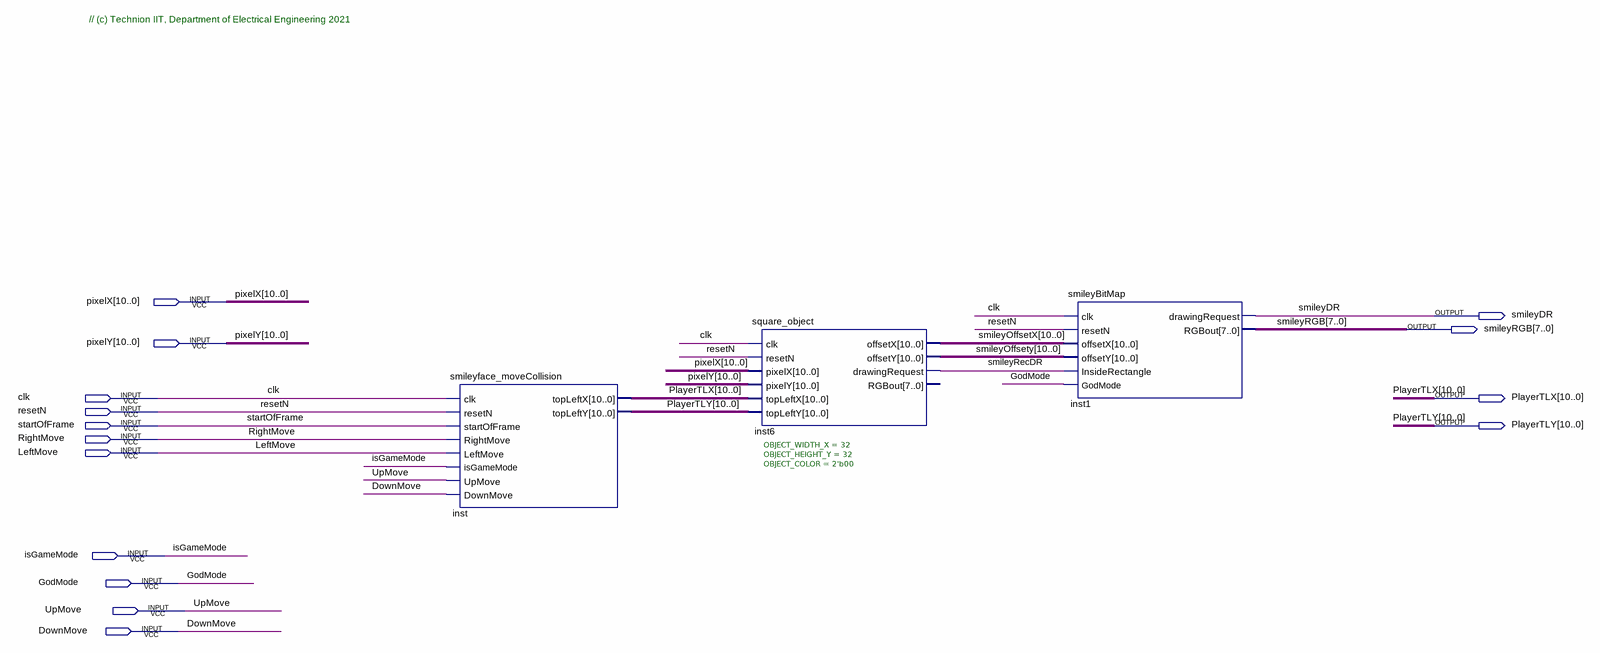
[diagram p0: schematic sheet]
// Quartus schematic Smiley_Block.bdf as structural Verilog: 3 symbols, 15 pins
module Smiley_Block (
  input  [10:0] pixelX,
  input  [10:0] pixelY,
  input  clk,
  input  resetN,
  input  startOfFrame,
  input  RightMove,
  input  LeftMove,
  input  isGameMode,
  input  GodMode,
  input  UpMove,
  input  DownMove,
  output smileyDR,
  output [7:0] smileyRGB,
  output [10:0] PlayerTLX,
  output [10:0] PlayerTLY
);

  wire smileyRecDR;
  wire [10:0] smileyOffsetX, smileyOffsety;

  smileyface_moveCollision inst (
    .clk(clk), .resetN(resetN), .startOfFrame(startOfFrame), .RightMove(RightMove), .LeftMove(LeftMove),
    .isGameMode(isGameMode), .UpMove(UpMove), .DownMove(DownMove), .topLeftX(PlayerTLX), .topLeftY(PlayerTLY));
  square_object #(.OBJECT_WIDTH_X(32), .OBJECT_HEIGHT_Y(32), .OBJECT_COLOR(2'b00)) inst6 (
    .clk(clk), .resetN(resetN), .pixelX(pixelX), .pixelY(pixelY), .topLeftX(PlayerTLX), .topLeftY(PlayerTLY),
    .offsetX(smileyOffsetX), .offsetY(smileyOffsety), .drawingRequest(smileyRecDR));  // open: RGBout
  smileyBitMap inst1 (
    .clk(clk), .resetN(resetN), .offsetX(smileyOffsetX), .offsetY(smileyOffsety),
    .InsideRectangle(smileyRecDR), .GodMode(GodMode), .drawingRequest(smileyDR), .RGBout(smileyRGB));

  // Notes on the sheet:
  //   // (c) Technion IIT, Department of Electrical Engineering 2021
endmodule
